# Altium schematic sheet USBi.SchDoc
size A4; Date: 08.04.2017; ApprovedBy: ApprovedBy; CheckedBy: CheckedBy; Author: Jan Petrik; CompanyName: FreeDSP; DrawnBy: Jan Petrik; Organization: FreeDSP; DocumentNumber: 14; Revision: B2; SheetNumber: 14; SheetTotal: 16; Version1: N/A; Version2: N/A; Version3: N/A; Change1description: N/A; Change2description: N/A; Change3description: N/A; Change1DrawnBy: N/A; Change2DrawnBy: N/A; Change3DrawnBy: N/A; Change1CheckedBy: N/A; Change2CheckedBy: N/A; Change3CheckedBy: N/A; PreviusVersion_Chng1: N/A; PreviusVersion_Chng2: N/A; PreviusVersion_Chng3: N/A; Variant1description: Standard assembly; Variant2description: N/A; Variant3description: N/A; Variant4description: N/A; email: jan_petrik@centrum.cz; license: CC BY-NC 4.0; DocumentName: Docname
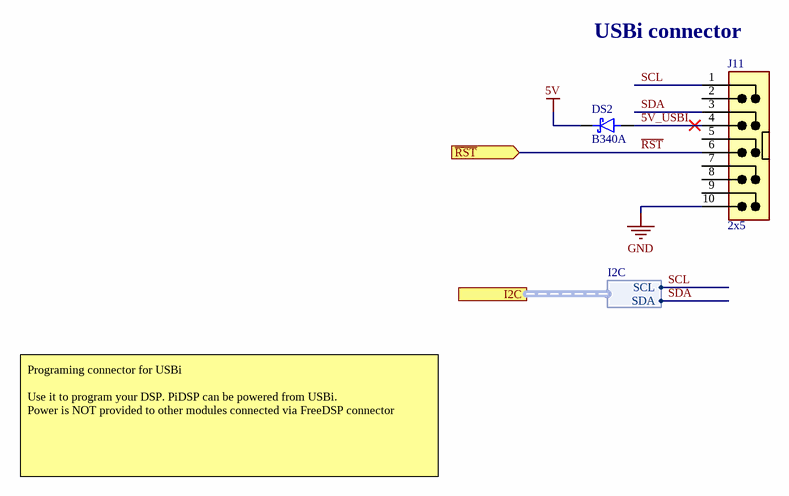
[diagram p0: USBi.SchDoc]

## Parts
DS2  B340A  [DIOM5127X23N(SMA)]
J11  2x5  [MLW10G_BK]

## Ports
I2C (harness I2C), ~{RST} (in)

## Harnesses
I2C: SCL, SDA

## Nets
5V: DS2.1(C)
GND: J11.10
5V_USBI: DS2.2(A) J11.4
~{RST}: J11.6 ; port ~{RST}
SCL: J11.1 ; port I2C.SCL
SDA: J11.3 ; port I2C.SDA

Not connected (* = marked no-connect by the designer): J11 2 5 7 8 9

## Notes on the sheet
- (near J11) USBi connector
- Programing connector for USBi
  Use it to program your DSP. PiDSP can be powered from USBi.
  Power is NOT provided to other modules connected via FreeDSP connector
- Designed by:
- Sheet Title:
- Board Revision:
- License:
- Email:
- www.freedsp.cc
- www.pidsp.com
- Date:
- Sheet:
- /

## Library data of the parts
DS2 = B340A: High Current Density SMT Schottky Rectifier, 3A/40V, SMA; SMD: 1; Supplier 1: Mouser; Supplier Part Number 1: 621-B340-F; Value: B340A
J11 = MLW 2x5: IDC Male Header for PCB 2x5 Pin, Straight; Author: JM 25.9.2014; SMD: 0; Supplier 1: Mouser; Supplier Part Number 1: 710-61201021621